# Altium schematic sheet Communication_Interfaces.SchDoc
size 420 x 297 mm; SheetNumber: 2; SheetTotal: 5
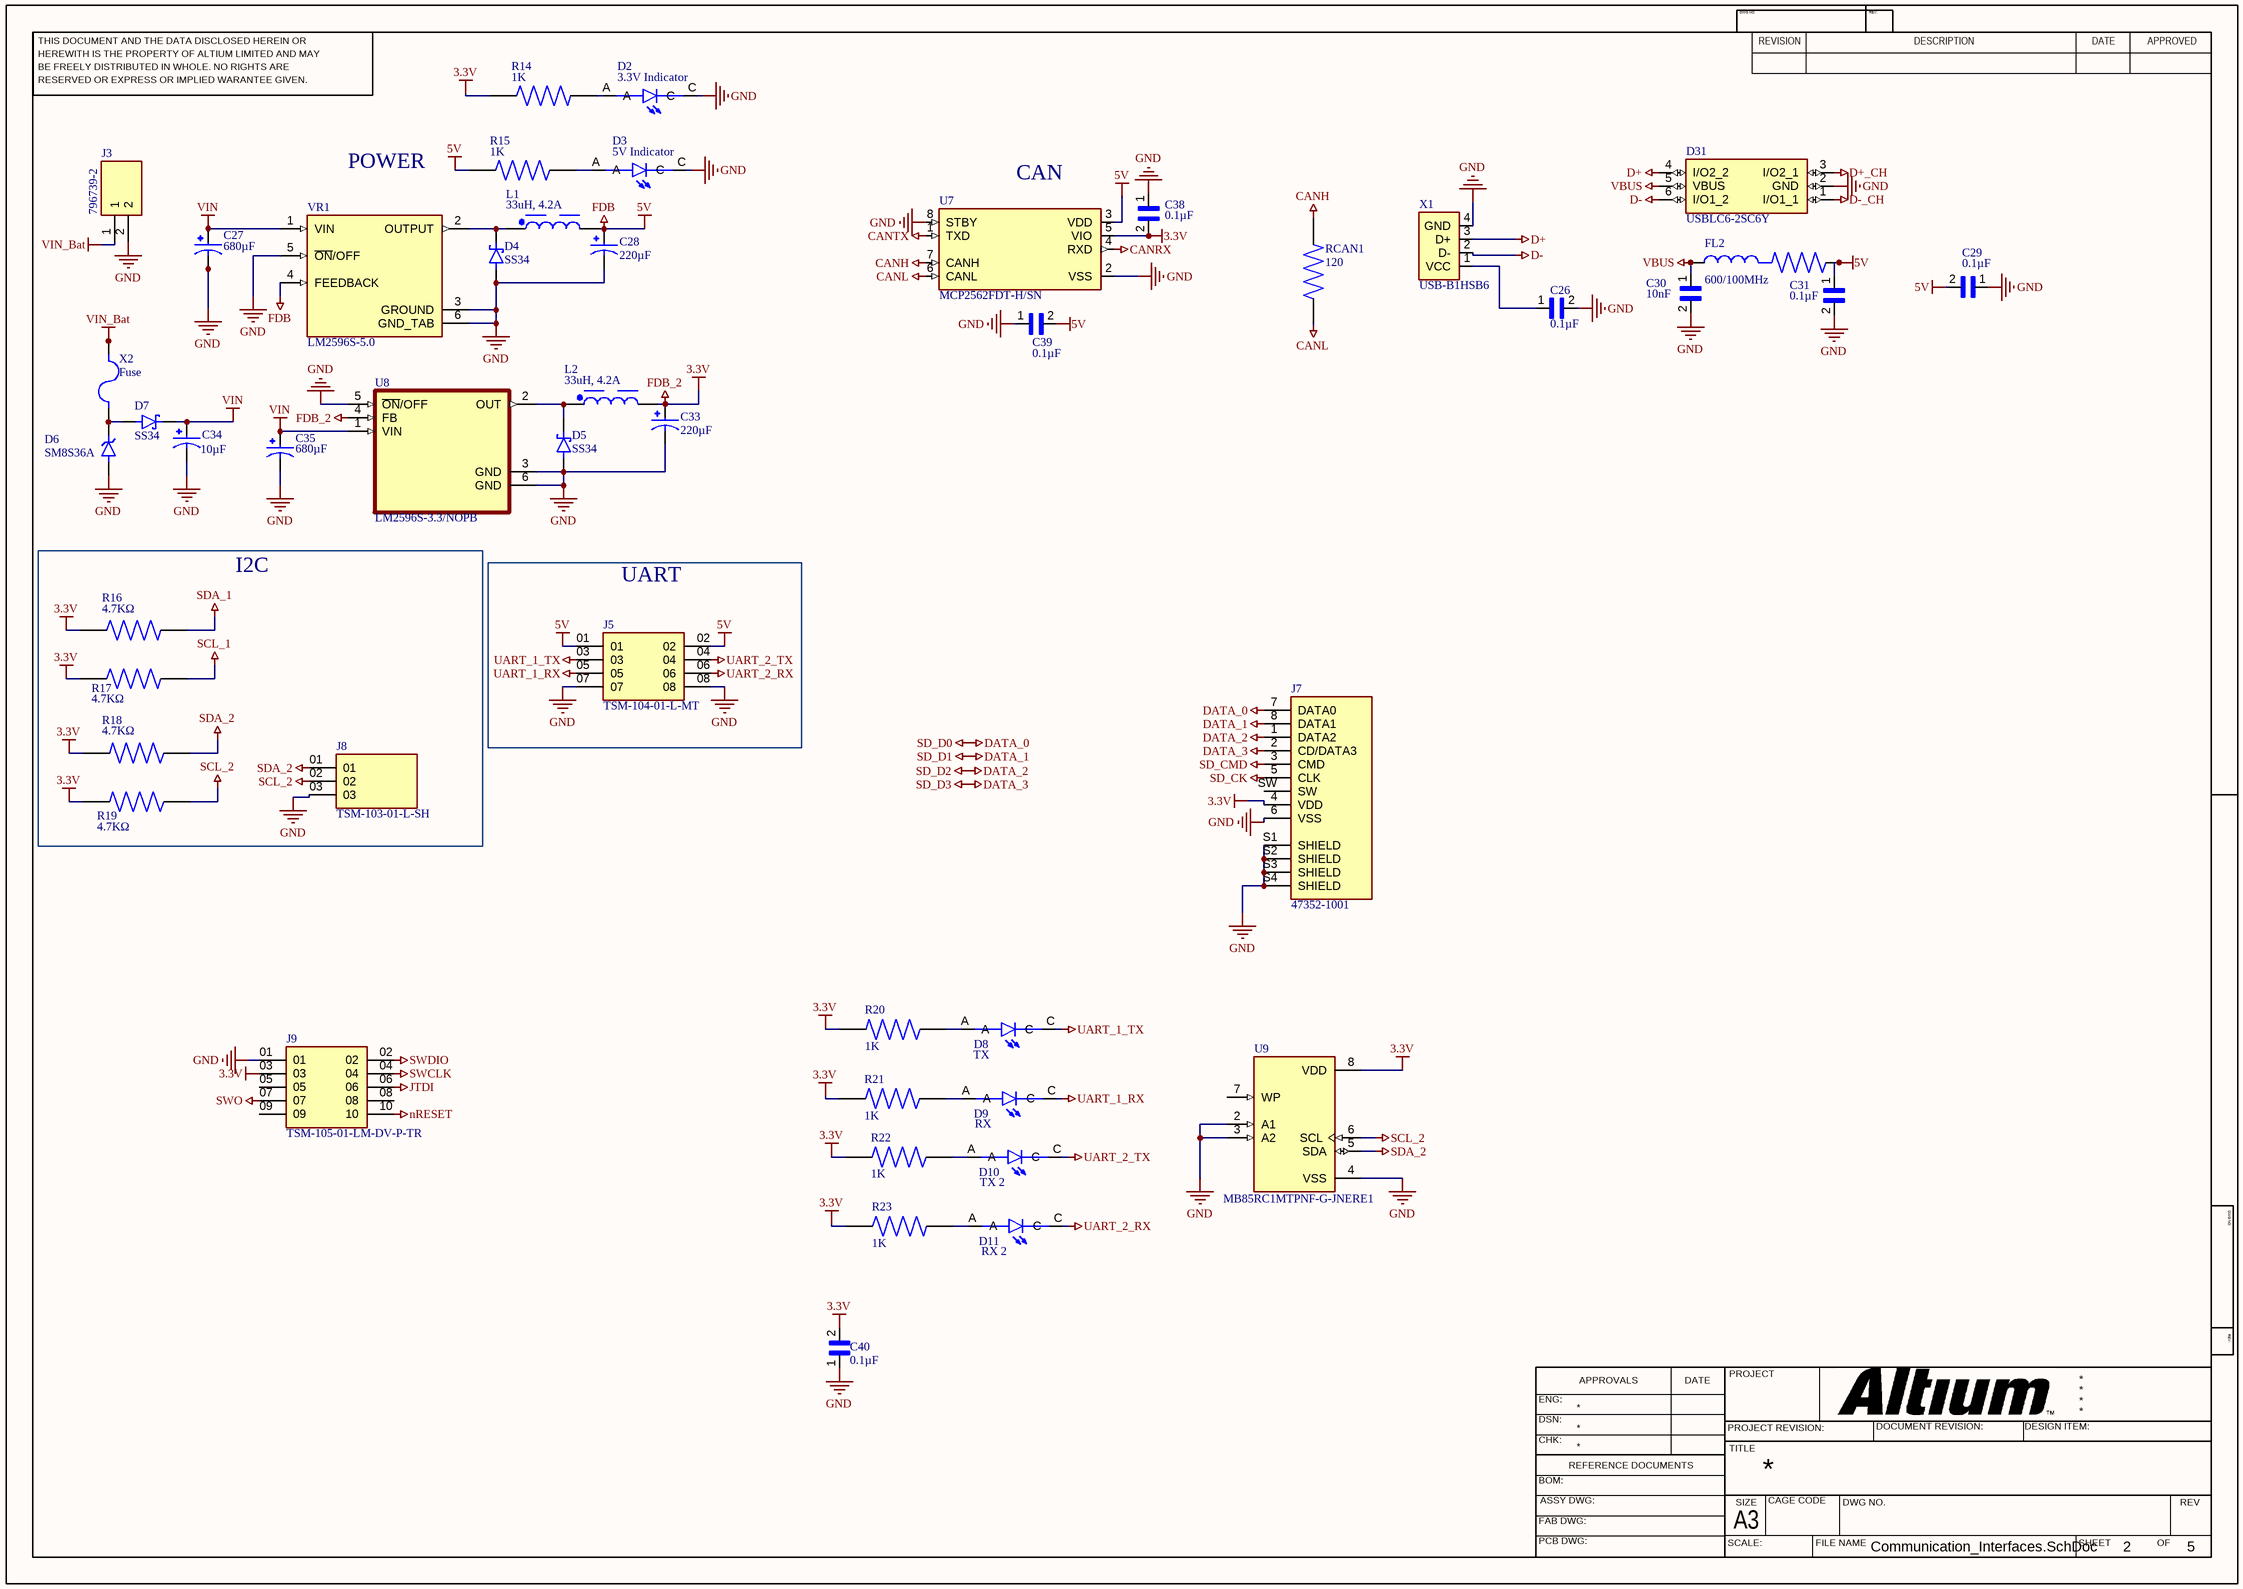
[diagram p0: Communication_Interfaces.SchDoc]

## Parts
C26  0.1µF  [CAPC1608X90N]
C27  680µF  [CAP_EEEFN1E681UV]
C28  220µF  [CAP_EEEFP1V221AV]
C29  0.1µF  [CAPC1608X90N]
C30  10nF  [CAPC1608X90N]
C31  0.1µF  [CAPC1608X90N]
C33  220µF  [CAP_EEEFP1V221AV]
C34  10µF  [CAPPRD500W50D500H1100]
C35  680µF  [CAP_EEEFN1E681UV]
C38  0.1µF  [CAPC1608X90N]
C39  0.1µF  [CAPC1608X90N]
C40  0.1µF  [CAPC1608X90N]
D2  3.3V Indicator  [LEDC2012X70N]
D3  5V Indicator  [LEDC2012X70N]
D4  SS34  [DIO_SS34]
D5  SS34  [DIO_SS34]
D6  SM8S36A  [TVSP_SM8S36A]
D7  SS34  [DIO_SS34]
D8  TX  [LEDC2012X70N]
D9  RX  [LEDC2012X70N]
D10  TX 2  [LEDC2012X70N]
D11  RX 2  [LEDC2012X70N]
D31  USBLC6-2SC6Y  [SOT95P280X145-6N]
FL2  600/100MHz  [BEADC1608X95N]
J3  796739-2  [TE_796739-2]
J5  TSM-104-01-L-MT  [SAMTEC_TSM-104-01-L-MT]
J7  47352-1001  [MOLEX_47352-1001]
J8  TSM-103-01-L-SH  [SAMTEC_TSM-103-01-L-SH]
J9  TSM-105-01-LM-DV-P-TR  [SAMTEC_TSM-105-01-LM-DV-P-TR]
L1  33uH, 4.2A  [WE-PD_1210]
L2  33uH, 4.2A  [WE-PD_1210]
R14  1K  [RESC3116X65N]
R15  1K  [RESC3116X65N]
R16  4.7KΩ  [RES_ERJS06J472V]
R17  4.7KΩ  [RES_ERJS06J472V]
R18  4.7KΩ  [RES_ERJS06J472V]
R19  4.7KΩ  [RES_ERJS06J472V]
R20  1K  [RESC3116X65N]
R21  1K  [RESC3116X65N]
R22  1K  [RESC3116X65N]
R23  1K  [RESC3116X65N]
RCAN1  120  [RESC3116X65N]
U7  MCP2562FDT-H/SN  [SOIC127P600X175-8N]
U8  LM2596S-3.3/NOPB  [VREG_LM2596S-3.3/NOPB]
U9  MB85RC1MTPNF-G-JNERE1  [SOIC127P600X175-8N]
VR1  LM2596S-5.0  [TO170P1524X483-6N]
X1  USB-B1HSB6  [OST_USB-B1HSB6]
X2  Fuse  [FUSE_3522-2]

## Blocks framed on the sheet
I2C: J8 R16-R19
UART: J5

## Nets
3.3V: C33.1 C38.2 C40.2 J7.4(VDD) J9.03 L2.2 R14.1 R16.2 R17.1 R18.2 R19.1 R20.1 R21.1 R22.1 R23.1 U7.5(VIO) U8.4(FB) U9.8(VDD)  [also labelled FDB_2]
5V: C28.1 C29.2 C31.1 C39.2 FL2.2 J5.01 J5.02 L1.2 R15.1 U7.3(VDD) VR1.4(FEEDBACK)  [also labelled FDB]
CANH: RCAN1.2 U7.7(CANH)
CANL: RCAN1.1 U7.6(CANL)
CANRX: U7.4(RXD)
CANTX: U7.1(TXD)
D+: D31.4(I/O2_2) X1.3(D+)
D+_CH: D31.3(I/O2_1)
D-: D31.6(I/O1_2) X1.2(D-)
D-_CH: D31.1(I/O1_1)
DATA_0: J7.7(DATA0)  [also labelled SD_D0]
DATA_1: J7.8(DATA1)  [also labelled SD_D1]
DATA_2: J7.1(DATA2)  [also labelled SD_D2]
DATA_3: J7.2(CD/DATA3)  [also labelled SD_D3]
GND: C26.2 C27.2 C28.2 C29.1 C30.2 C31.2 C33.2 C34.N C35.2 C38.1 C39.1 C40.1 D2.C D3.C D4.A D5.A D6.2(A) D31.2(GND) J3.2 J5.07 J5.08 J7.6(VSS) J7.S1(SHIELD) J7.S2(SHIELD) J7.S3(SHIELD) J7.S4(SHIELD) J8.03 J9.01 U7.2(VSS) U7.8(STBY) U8.3(GND) U8.5(~{ON}/OFF) U8.6(GND) U9.2(A1) U9.3(A2) U9.4(VSS) VR1.3(GROUND) VR1.5(~{ON}/OFF) VR1.6(GND_TAB) X1.4(GND)
JTDI: J9.06
nRESET: J9.10
SCL_1: R17.2
SCL_2: J8.02 R19.2 U9.6(SCL)
SD_CK: J7.5(CLK)
SD_CMD: J7.3(CMD)
SDA_1: R16.1
SDA_2: J8.01 R18.1 U9.5(SDA)
SWCLK: J9.04
SWDIO: J9.02
SWO: J9.07
UART_1_RX: D9.C J5.05
UART_1_TX: D8.C J5.03
UART_2_RX: D11.C J5.06
UART_2_TX: D10.C J5.04
VBUS: C30.1 D31.5(VBUS) FL2.1
VIN: C27.1 C34.P C35.1 D7.C(K) U8.1(VIN) VR1.1(VIN)
VIN_Bat: J3.1 X2.2A X2.2B
NetC26_1: C26.1 X1.1(VCC)
NetD2_A: D2.A R14.2
NetD3_A: D3.A R15.2
NetD4_C: D4.C(K) L1.1 VR1.2(OUTPUT)
NetD5_C: D5.C(K) L2.1 U8.2(OUT)
NetD6_1: D6.1(K) D7.A X2.1A X2.1B
NetD8_A: D8.A R20.2
NetD9_A: D9.A R21.2
NetD10_A: D10.A R22.2
NetD11_A: D11.A R23.2

Not connected (* = marked no-connect by the designer): J7 SW; J9 05 08 09; U9 7(WP)

## Notes on the sheet
- (near VR1) POWER
- (near U7) CAN
- THIS DOCUMENT AND THE DATA DISCLOSED HEREIN OR
- HEREWITH IS THE PROPERTY OF ALTIUM LIMITED AND MAY
- DWG NO:
- REVISION
- REV:
- DESCRIPTION
- DATE
- APPROVED
- BE FREELY DISTRIBUTED IN WHOLE. NO RIGHTS ARE
- RESERVED OR EXPRESS OR IMPLIED WARANTEE GIVEN.
- ENG:
- APPROVALS
- PROJECT
- DSN:
- CHK:
- REFERENCE DOCUMENTS
- PROJECT REVISION:
- TITLE
- DOCUMENT REVISION:
- DESIGN ITEM:
- BOM:
- FAB DWG:
- PCB DWG:
- ASSY DWG:
- SCALE:
- A3
- SIZE
- CAGE CODE
- FILE NAME
- DWG NO.
- SHEET
- OF
- REV

## Library data of the parts
C26 C29-C31 C38-C40 = 06035C104MAZ2A: Multilayer Ceramic Capacitors MLCC - SMD/SMT; Package: None; Price: None; Value: *; MP: 06035C104MAZ2A; Availability: Unavailable
C27 C35 = EEEFN1E681UV: CAP ALUM 680UF 20% 25V SMD; MF: Panasonic Electronic Components; MP: EEE-FN1E681UV; Value: *; Purchase-URL: https://pricing.snapeda.com/search/part/EEE-FN1E681UV/?ref=eda; Price: None; Check_prices: https://www.snapeda.com/parts/EEE-FN1E681UV/Panasonic/view-part/6178425/?ref=eda; Package: RADIAL-2 Panasonic; Availability: In Stock; SnapEDA_Link: https://www.snapeda.com/parts/EEE-FN1E681UV/Panasonic/view-part/6178425/?ref=snap
C28 C33 = EEEFP1V221AV: CAP ALUM 220UF 20% 35V SMD; MF: Panasonic Electronic Components; MP: EEE-FP1V221AV; SnapEDA_Link: https://www.snapeda.com/parts/EEE-FP1V221AV/Panasonic/view-part/4900934/?ref=snap; Price: None; Availability: Not in stock; Value: *; Check_prices: https://www.snapeda.com/parts/EEE-FP1V221AV/Panasonic/view-part/4900934/?ref=eda; Package: RADIAL-2 Panasonic
C34 = ECEA1EN100UB: 10ÂµF 25V Aluminum Electrolytic Capacitors Radial, Can 2000 Hrs @ 85Â°C; MF: Panasonic; SnapEDA_Link: https://www.snapeda.com/parts/ECEA1EN100UB/Panasonic/view-part/?ref=snap; Price: None; Check_prices: https://www.snapeda.com/parts/ECEA1EN100UB/Panasonic/view-part/?ref=eda; Purchase-URL: https://pricing.snapeda.com/search/part/ECEA1EN100UB/?ref=eda; Package: RADIAL-2 Panasonic; MP: ECEA1EN100UB; Value: *; Availability: In Stock
D2 D3 D8-D11 = 597-3305-607F: LED Uni-Color Green 4-Pin Chip 0805 T/R; Availability: Unavailable; Value: *; Price: None; MP: 597-3305-607F; Package: None
D4 D5 D7 = SS34: 3A, 40V, Schottky Rectifier; MF: Taiwan Semiconductor; Package: DO-214AB-2 Taiwan Semiconductor; Value: *; MP: SS34
  D4 D5: SnapEDA_Link: https://www.snapeda.com/parts/SS34/Taiwan+Semiconductor/view-part/?ref=snap; Check_prices: https://www.snapeda.com/parts/SS34/Taiwan+Semiconductor/view-part/?ref=eda
  D7: SnapEDA_Link: https://www.snapeda.com/parts/SS34/taiwan/view-part/?ref=snap; Check_prices: https://www.snapeda.com/parts/SS34/taiwan/view-part/?ref=eda
D31 = USBLC6-2SC6Y: 17V Clamp 5A (8/20µs) Ipp Tvs Diode Surface Mount SOT-23-6; MF: STMicroelectronics; SnapEDA_Link: https://www.snapeda.com/parts/USBLC6-2SC6Y/STMicroelectronics/view-part/?ref=snap; Package: SOT-23-6 STMicroelectronics; Value: *; MP: USBLC6-2SC6Y; Check_prices: https://www.snapeda.com/parts/USBLC6-2SC6Y/STMicroelectronics/view-part/?ref=eda
FL2 = BLM18DN601SZ1D: 600 Ohms @ 100MHz 1 Ferrite Bead 0603 _1608 Metric_ 700mA; MF: Murata; Package: 1608 Murata; Availability: Unavailable; Value: *; MP: BLM18DN601SZ1D; SnapEDA_Link: https://www.snapeda.com/parts/BLM18DN601SZ1D/Murata/view-part/4302620/?ref=snap; Price: None
J3 = 796739-2: Conn Terminal Block F 2 POS 9.53mm Solder RA Thru-Hole 32A/Contact; MF: TE Connectivity; Number_of_Positions: 2; Centerline_Pitch: 9.53 mm[.375 in]; Package: None; Value: *; Price: None; EU_RoHS_Compliance: Compliant with Exemptions; MP: 796739-2; TE_purchase_URL: https://www.te.com/usa-en/product-796739-2.html?te_bu=Cor&te_type=disp&te_campaign=seda_glo_cor-seda-global-disp-prtnr-fy19-seda-model-bom-cta_sma-317_1&elqCampaignId=32493; Availability: Unavailable; SnapEDA_Link: https://www.snapeda.com/parts/796739-2/TE%20Connectivity%20AMP%20Connectors/view-part/279084/?ref=snap
J5 = TSM-104-01-L-MT: TSM Series .100 Surface Mount Terminal Strip; MF: Samtec; SnapEDA_Link: https://www.snapeda.com/parts/TSM-104-01-L-MT/Samtec/view-part/?ref=snap; Package: None; Value: *; MP: TSM-104-01-L-MT; Check_prices: https://www.snapeda.com/parts/TSM-104-01-L-MT/Samtec/view-part/?ref=eda
J7 = 47352-1001: 8 (6 + 2) Position Card Connector Secure Digital - microSDâ„¢ Surface Mount, Right Angle Gold; MP: 473521001; MF: Molex; Price: None; Availability: In Stock; Package: None; Value: *; Purchase-URL: https://pricing.snapeda.com/search/part/473521001/?ref=eda
J8 = TSM-103-01-L-SH: MF: Samtec Inc.; Package: None; MP: TSM-103-01-L-SH; Value: *; Price: None; Availability: Unavailable
J9 = TSM-105-01-LM-DV-P-TR: TSM - Samtec 2.54mm Dual Row Vertical Surface Mount Header 5.84mm Post Height (01) - Fast Stock; Check_prices: https://www.snapeda.com/parts/TSM-105-01-LM-DV-P-TR/Samtec/view-part/3284031/?ref=eda; MF: Samtec; Package: None; Purchase-URL: https://pricing.snapeda.com/search/part/TSM-105-01-LM-DV-P-TR/?ref=eda; Availability: In Stock; Value: *; MP: TSM-105-01-LM-DV-P-TR; SnapEDA_Link: https://www.snapeda.com/parts/TSM-105-01-LM-DV-P-TR/Samtec/view-part/3284031/?ref=snap; Price: None
L1 L2 = 7447709330: WE-PD SMT Power Inductor, size 1210, 33uH, 4.2A, 45mOhm; Manufacturer: Wurth Elektronik; Case/Size Code: 1210; DC Resistance: 37mOhm; Saturation Current: 5.5A; Self Resonant Frequency: 8.5MHz; Type: Standard; Manufacturer Part Number: 7447709330; Category: Power Inductors; Match Code: WE-PD; ComponentLink1Description: Website Link; ComponentLink1URL: https://www.we-online.com/redexpert/article/7447709330?ad; ComponentLink2Description: Datasheet Link; ComponentLink2URL: https://www.we-online.com/redexpert/spec/7447709330?ad; Mount: Surface Mount; Operating Temperature Max: 125°C; Operating Temperature Min: -40°C; Packaging: Tape and Reel; Length: 12mm; Width: 12mm; Height: 10mm; DC Resistance Max: 45mOhm; Inductance: 33uH; Rated Current: 4.2A
R14 R15 R20-R23 = RC1206JR-071KL: RES, THICK FILM, 1K, 5%, 0.25W, 1206; Resistance:1kohm; Resistance Tolerance:Â± 5%; Power Rating:250mW; Resistor Case Style:1206 ^3216 Metric]; Resistor Technology:Thick Film; Resistor Type:General Purpose; Product Range:RC Series; MF: Yageo Corporation; MP: RC1206JR071KL; SnapEDA_Link: https://www.snapeda.com/parts/RC1206JR071KL/Yageo/view-part/?ref=snap; Package: 1206-2 YAGEO; Value: *; Check_prices: https://www.snapeda.com/parts/RC1206JR071KL/Yageo/view-part/?ref=eda
R16-R19 = ERJS06J472V: Price: None; Availability: Unavailable; MP: ERJS06J472V; Package: None; Value: *
RCAN1 = AA1206JR-07470RL: Package: None; Price: None; Value: *; MP: AA1206JR-07470RL; Availability: Unavailable
U7 = MCP2562FDT-H/SN: CAN Flexible Data Rate Transceiver | Microchip Technology Inc. MCP2562FDT-H/SN; SnapEDA_Link: https://www.snapeda.com/parts/MCP2562FDT-H/SN/Microchip/view-part/?ref=snap; Package: SO-8 Microchip; Value: *; MF: Microchip; MP: MCP2562FDT-H/SN; Check_prices: https://www.snapeda.com/parts/MCP2562FDT-H/SN/Microchip/view-part/?ref=eda
U9 = MB85RC1MTPNF-G-JNERE1: FRAM _Ferroelectric RAM_ Memory IC 1Mb _128K x 8_ IÂ²C 3.4MHz 130ns 8-SOP; MF: Fujitsu Electronics; MP: MB85RC1MTPNF-G-JNERE1; Price: None; SnapEDA_Link: https://www.snapeda.com/parts/MB85RC1MTPNF-G-JNERE1/Fujitsu%20Electronics%20America%2C%20Inc./view-part/2842124/?ref=snap; Availability: Unavailable; Value: *; Package: SO-8 Fujitsu
VR1 = LM2596S-5.0: SIMPLE SWITCHER&reg; 4.5V to 40V, 3A Low Component Count Step-Down Regulator; MP: LM2596S-5.0/NOPB; MF: Texas Instruments; Price: None; Availability: In Stock; Package: TO-263-5 Texas Instruments; SnapEDA_Link: https://www.snapeda.com/parts/LM2596S-5.0/NOPB/Texas+Instruments/view-part/?ref=snap; Check_prices: https://www.snapeda.com/parts/LM2596S-5.0/NOPB/Texas+Instruments/view-part/?ref=eda; Value: *; Purchase-URL: https://pricing.snapeda.com/search/part/LM2596S-5.0/NOPB/?ref=eda
X1 = USB-B1HSB6: USB-B (USB TYPE-B) - Receptacle Connector 4 Position Through Hole, Right Angle; MF: On Shore; Check_prices: https://www.snapeda.com/parts/USB-B1HSB6/On+Shore+Technology+Inc./view-part/?ref=eda; Value: *; Purchase-URL: https://pricing.snapeda.com/search/part/USB-B1HSB6/?ref=eda; Price: None; MP: USB-B1HSB6; SnapEDA_Link: https://www.snapeda.com/parts/USB-B1HSB6/On+Shore+Technology+Inc./view-part/?ref=snap; Availability: In Stock; Package: None
X2 = 3522-2: MF: {'manufacturer': u'Keystone Electronics'}; Availability: Unavailable; Price: None; Value: *; MP: 3522-2; Package: None
D6 = SM8S36A: Package: None; Price: None; Value: *; MP: SM8S36A; Availability: Unavailable
U8 = LM2596S-3.3/NOPB: MP: LM2596S-3.3/NOPB; Availability: Unavailable; Package: None; Value: *; Price: None